# EAGLE schematic TiNRS-Ardabil (EAGLE 7.7.0)

## Sheet 1 of 2
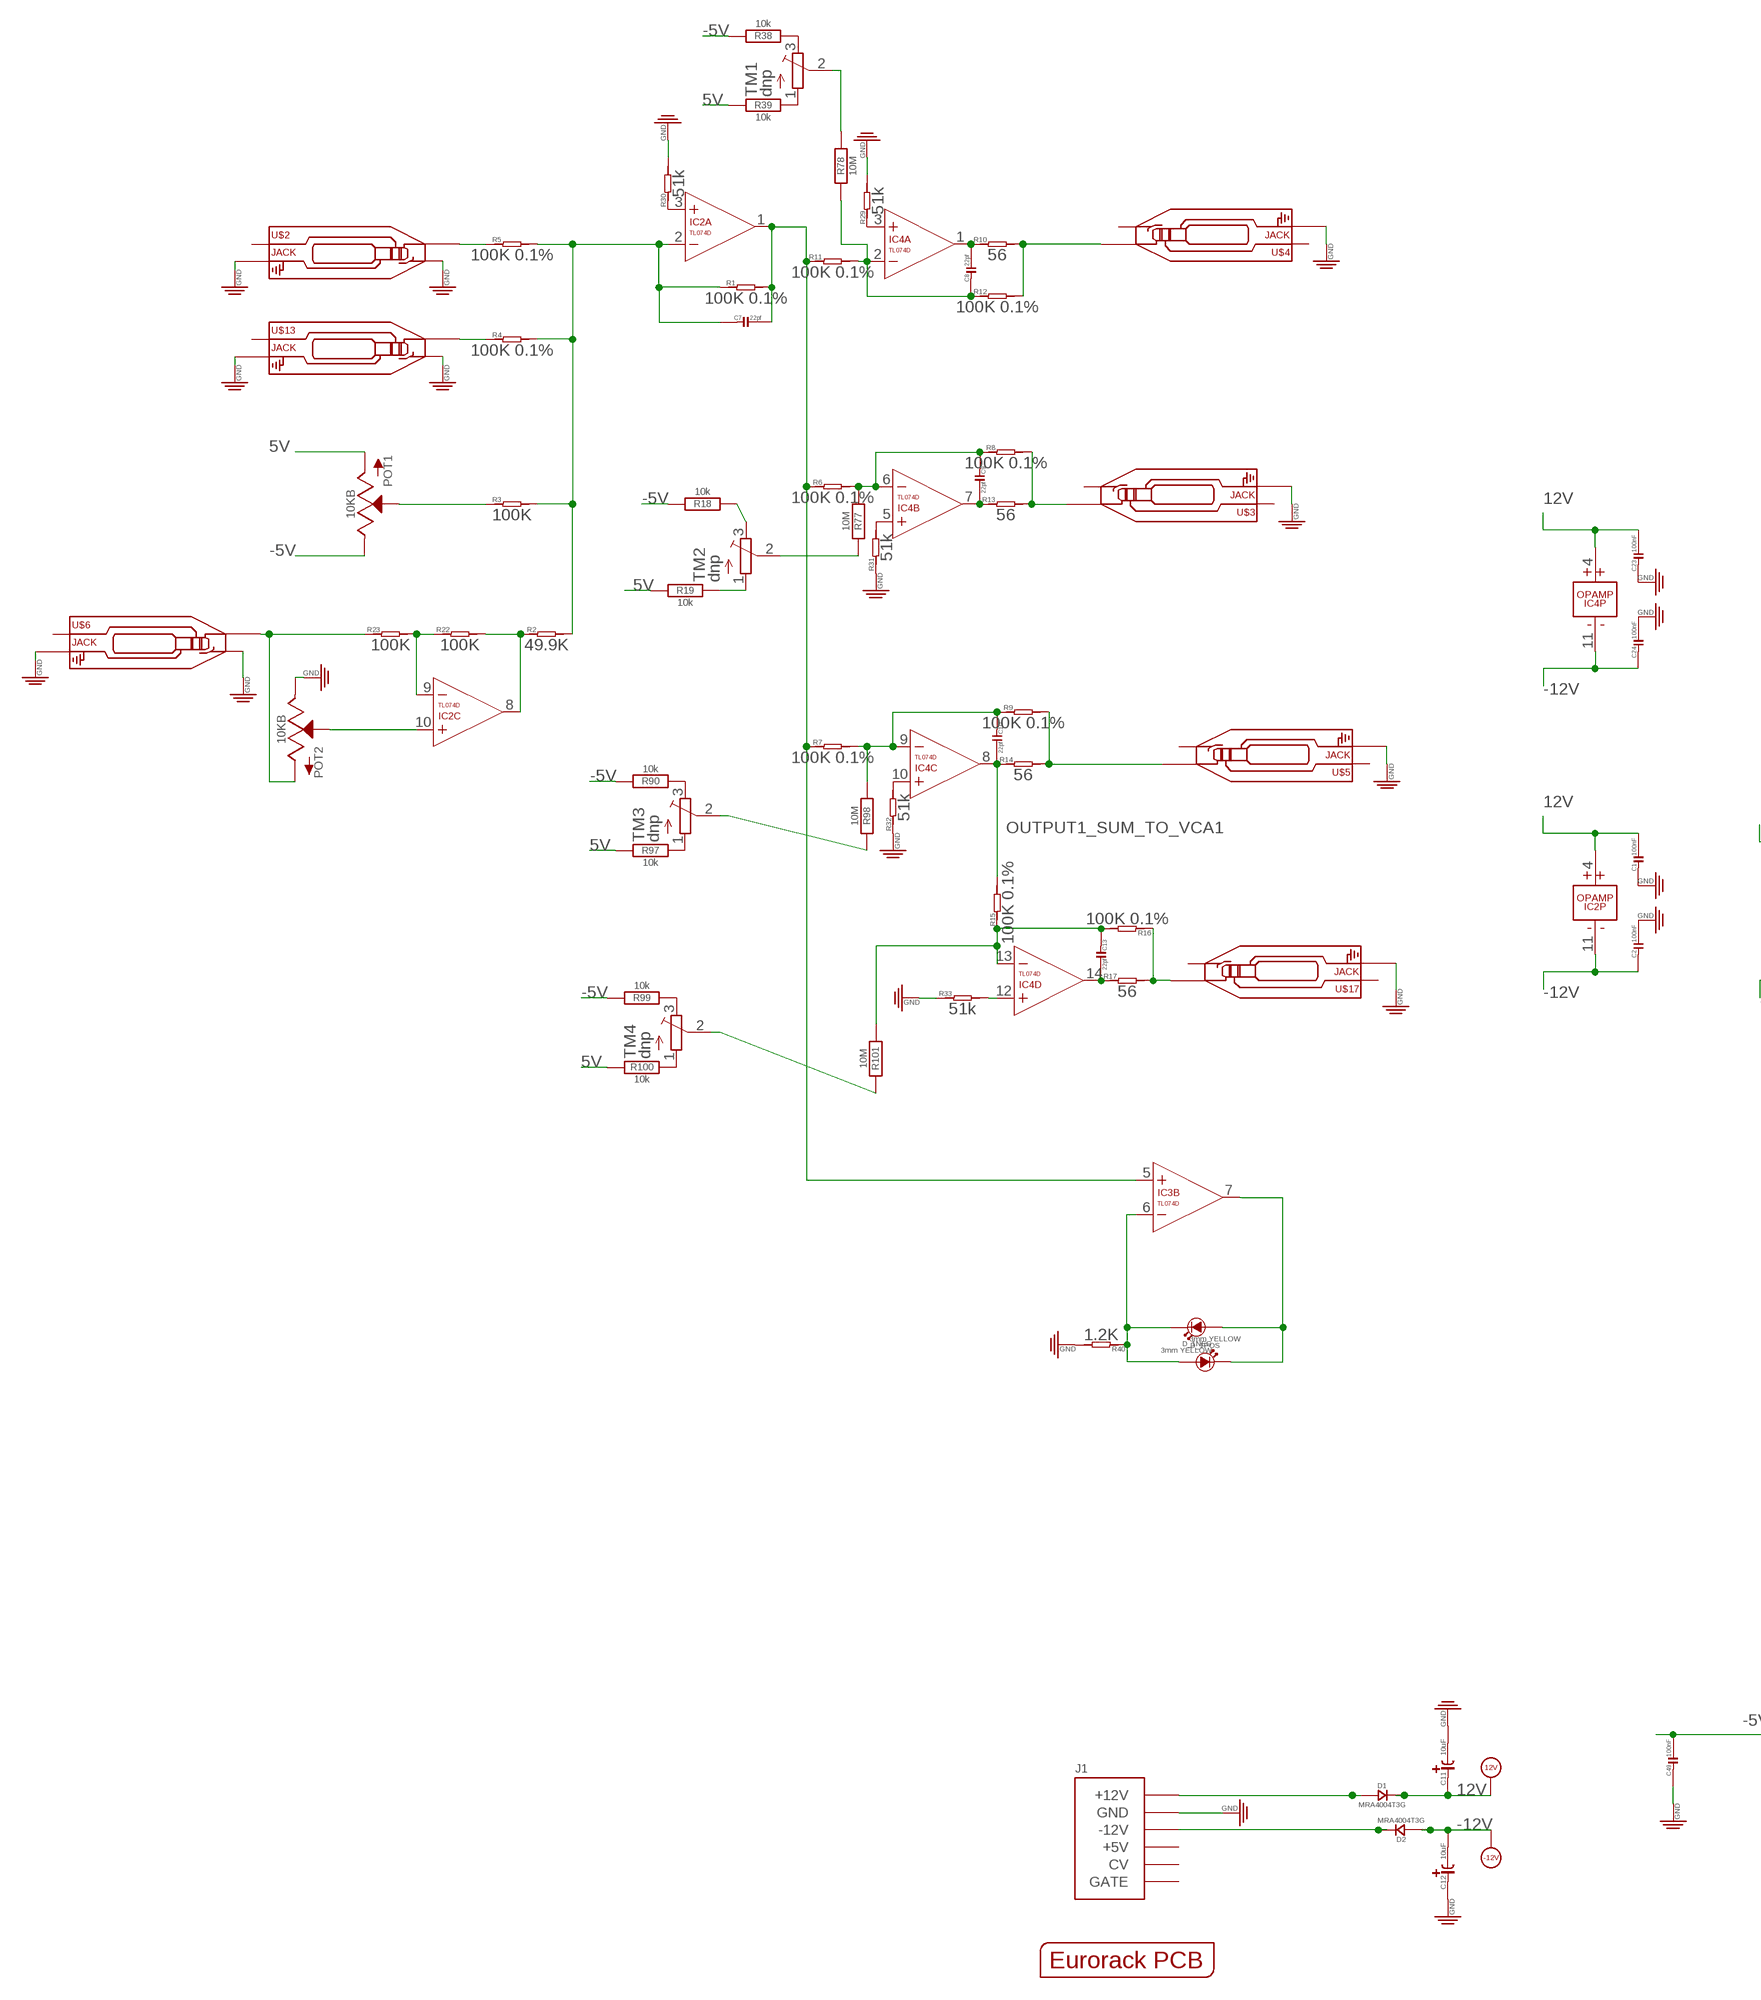
[diagram p0: schematic, sheet 1, part 1 of 2]
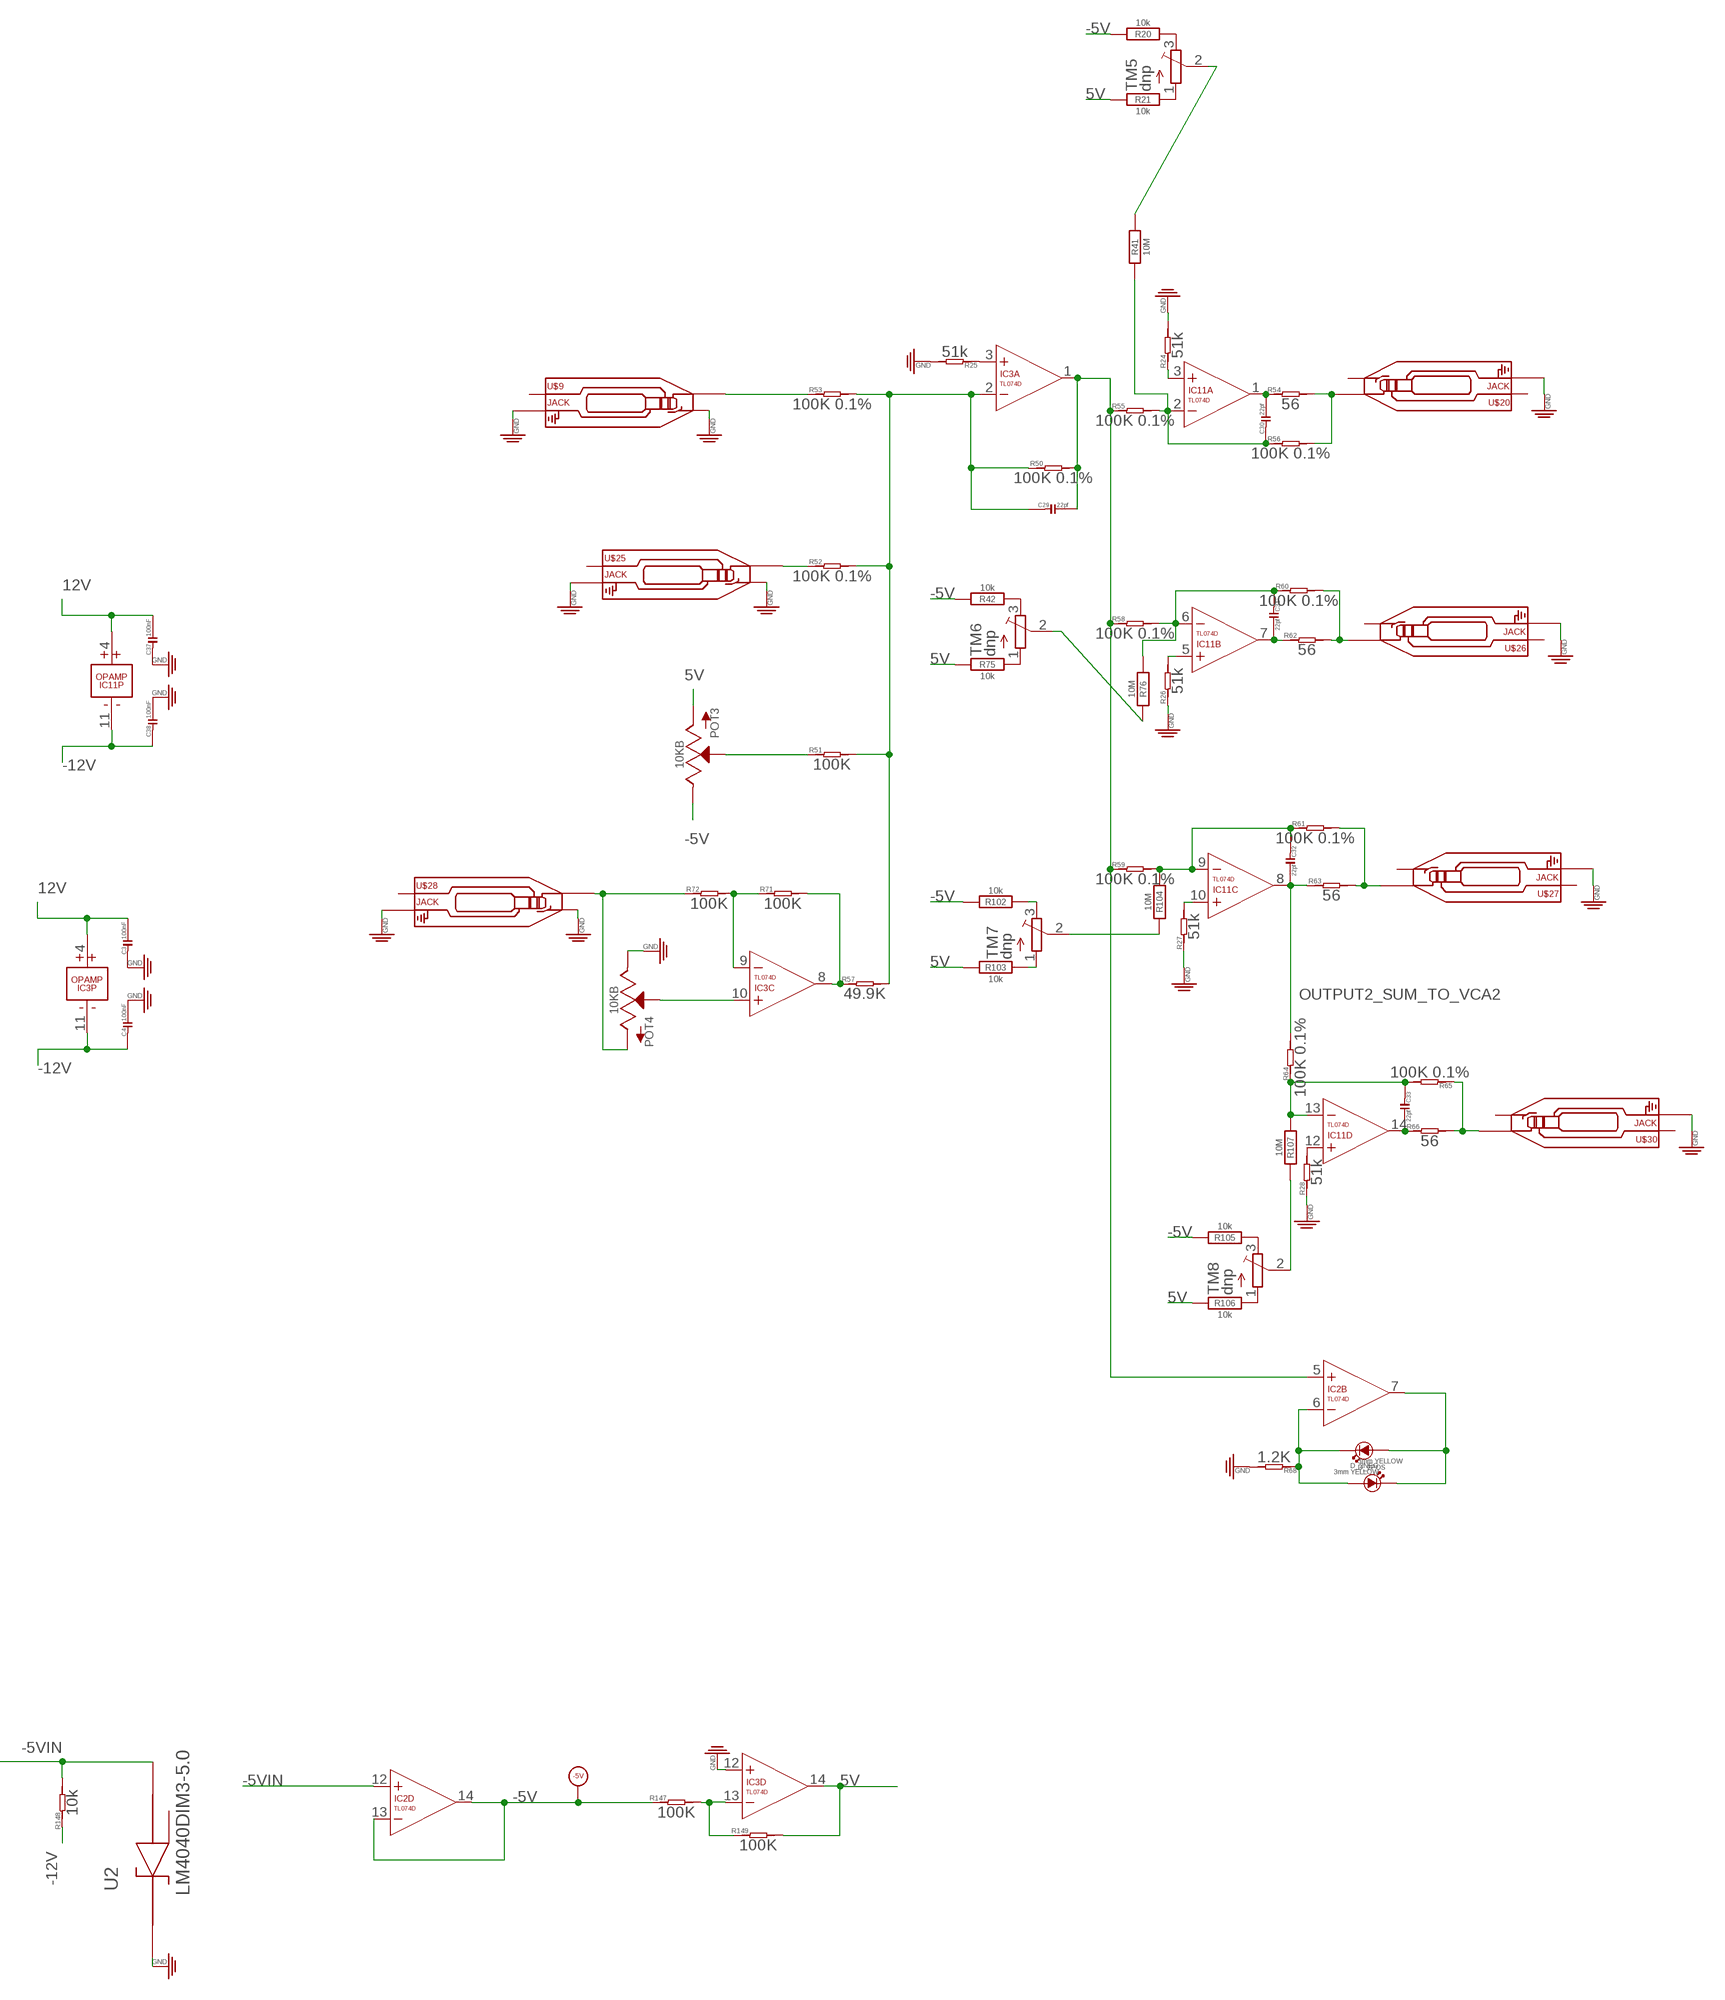
[diagram p1: schematic, sheet 1, part 2 of 2]

### Parts
C1  100nF  C-0603  [C0603]
C2  100nF  C-0603  [C0603]
C3  100nF  C-0603  [C0603]
C4  100nF  C-0603  [C0603]
C7  22pf  C-0603  [C0603]
C8  22pf  C-0603  [C0603]
C9  22pf  C-0603  [C0603]
C10  22pf  C-0603  [C0603]
C11  10uF  C-POLAR-A  [CASE-A_3216]
C12  10uF  C-POLAR-A  [CASE-A_3216]
C13  22pf  C-0603  [C0603]
C23  100nF  C-0603  [C0603]
C24  100nF  C-0603  [C0603]
C29  22pf  C-0603  [C0603]
C30  22pf  C-0603  [C0603]
C31  22pf  C-0603  [C0603]
C32  22pf  C-0603  [C0603]
C33  22pf  C-0603  [C0603]
C37  100nF  C-0603  [C0603]
C38  100nF  C-0603  [C0603]
C49  100nF  C-0603  [C0603]
D1  MRA4004T3G  D-SMA  [DO-214AC]
D2  MRA4004T3G  D-SMA  [DO-214AC]
D_1NEG  3mm YELLOW  LED3MM  [3MMLED]
D_1POS  3mm YELLOW  LED3MM  [3MMLED]
D_2NEG  3mm YELLOW  LED3MM  [3MMLED]
D_2POS  3mm YELLOW  LED3MM  [3MMLED]
IC2  TL074D  [SO14]
IC3  TL074D  [SO14]
IC4  TL074D  [SO14]
IC11  TL074D  [SO14]
J1  POWER_SHROUDED_NOTEXT  [POWER_16_SHROUDED_NOTEXT]
POT1  10KB  POTSQUAREHOLE_SMALLKNOB  [ALPS_POT_SQUAREHOLES]
POT2  10KB  POTSQUAREHOLE_SMALLKNOB  [ALPS_POT_SQUAREHOLES]
POT3  10KB  POTSQUAREHOLE_SMALLKNOB  [ALPS_POT_SQUAREHOLES]
POT4  10KB  POTSQUAREHOLE_SMALLKNOB  [ALPS_POT_SQUAREHOLES]
R1  100K 0.1%  R-0603  [R0603]
R2  49.9K  R-0603  [R0603]
R3  100K  R-0603  [R0603]
R4  100K 0.1%  R-0603  [R0603]
R5  100K 0.1%  R-0603  [R0603]
R6  100K 0.1%  R-0603  [R0603]
R7  100K 0.1%  R-0603  [R0603]
R8  100K 0.1%  R-0603  [R0603]
R9  100K 0.1%  R-0603  [R0603]
R10  56  R-0603  [R0603]
R11  100K 0.1%  R-0603  [R0603]
R12  100K 0.1%  R-0603  [R0603]
R13  56  R-0603  [R0603]
R14  56  R-0603  [R0603]
R15  100K 0.1%  R-0603  [R0603]
R16  100K 0.1%  R-0603  [R0603]
R17  56  R-0603  [R0603]
R18  10k  R-EU_R0402  [R0402]
R19  10k  R-EU_R0402  [R0402]
R20  10k  R-EU_R0402  [R0402]
R21  10k  R-EU_R0402  [R0402]
R22  100K  R-0603  [R0603]
R23  100K  R-0603  [R0603]
R24  51k  R-0603  [R0603]
R25  51k  R-0603  [R0603]
R26  51k  R-0603  [R0603]
R27  51k  R-0603  [R0603]
R28  51k  R-0603  [R0603]
R29  51k  R-0603  [R0603]
R30  51k  R-0603  [R0603]
R31  51k  R-0603  [R0603]
R32  51k  R-0603  [R0603]
R33  51k  R-0603  [R0603]
R38  10k  R-EU_R0402  [R0402]
R39  10k  R-EU_R0402  [R0402]
R40  1.2K  R-0603  [R0603]
R41  10M  R-EU_R0402  [R0402]
R42  10k  R-EU_R0402  [R0402]
R50  100K 0.1%  R-0603  [R0603]
R51  100K  R-0603  [R0603]
R52  100K 0.1%  R-0603  [R0603]
R53  100K 0.1%  R-0603  [R0603]
R54  56  R-0603  [R0603]
R55  100K 0.1%  R-0603  [R0603]
R56  100K 0.1%  R-0603  [R0603]
R57  49.9K  R-0603  [R0603]
R58  100K 0.1%  R-0603  [R0603]
R59  100K 0.1%  R-0603  [R0603]
R60  100K 0.1%  R-0603  [R0603]
R61  100K 0.1%  R-0603  [R0603]
R62  56  R-0603  [R0603]
R63  56  R-0603  [R0603]
R64  100K 0.1%  R-0603  [R0603]
R65  100K 0.1%  R-0603  [R0603]
R66  56  R-0603  [R0603]
R68  1.2K  R-0603  [R0603]
R71  100K  R-0603  [R0603]
R72  100K  R-0603  [R0603]
R75  10k  R-EU_R0402  [R0402]
R76  10M  R-EU_R0402  [R0402]
R77  10M  R-EU_R0402  [R0402]
R78  10M  R-EU_R0402  [R0402]
R90  10k  R-EU_R0402  [R0402]
R97  10k  R-EU_R0402  [R0402]
R98  10M  R-EU_R0402  [R0402]
R99  10k  R-EU_R0402  [R0402]
R100  10k  R-EU_R0402  [R0402]
R101  10M  R-EU_R0402  [R0402]
R102  10k  R-EU_R0402  [R0402]
R103  10k  R-EU_R0402  [R0402]
R104  10M  R-EU_R0402  [R0402]
R105  10k  R-EU_R0402  [R0402]
R106  10k  R-EU_R0402  [R0402]
R107  10M  R-EU_R0402  [R0402]
R147  100K  R-0603  [R0603]
R148  10k  R-0603  [R0603]
R149  100K  R-0603  [R0603]
TM1  dnp  TRIMPOTTC33X  [TC33X]
TM2  dnp  TRIMPOTTC33X  [TC33X]
TM3  dnp  TRIMPOTTC33X  [TC33X]
TM4  dnp  TRIMPOTTC33X  [TC33X]
TM5  dnp  TRIMPOTTC33X  [TC33X]
TM6  dnp  TRIMPOTTC33X  [TC33X]
TM7  dnp  TRIMPOTTC33X  [TC33X]
TM8  dnp  TRIMPOTTC33X  [TC33X]
U2  LM4040DIM3-5.0  [SOT95P237X112-3N]
U$1  EURORACK_PCB12HP  [EURORACK12HPPCB]
U$2  JACK  AUDIO-JACK_SMALLSYMBOL  [3.5MM-JACK-SWITCH-13MM-NOHOLES-TESTPAD]
U$3  JACK  AUDIO-JACK_SMALLSYMBOL  [3.5MM-JACK-SWITCH-13MM-NOHOLES-TESTPAD]
U$4  JACK  AUDIO-JACK_SMALLSYMBOL  [3.5MM-JACK-SWITCH-13MM-NOHOLES-TESTPAD]
U$5  JACK  AUDIO-JACK_SMALLSYMBOL  [3.5MM-JACK-SWITCH-13MM-NOHOLES-TESTPAD]
U$6  JACK  AUDIO-JACK_SMALLSYMBOL  [3.5MM-JACK-SWITCH-13MM-NOHOLES-TESTPAD]
U$9  JACK  AUDIO-JACK_SMALLSYMBOL  [3.5MM-JACK-SWITCH-13MM-NOHOLES-TESTPAD]
U$13  JACK  AUDIO-JACK_SMALLSYMBOL  [3.5MM-JACK-SWITCH-13MM-NOHOLES-TESTPAD]
U$17  JACK  AUDIO-JACK_SMALLSYMBOL  [3.5MM-JACK-SWITCH-13MM-NOHOLES-TESTPAD]
U$20  JACK  AUDIO-JACK_SMALLSYMBOL  [3.5MM-JACK-SWITCH-13MM-NOHOLES-TESTPAD]
U$25  JACK  AUDIO-JACK_SMALLSYMBOL  [3.5MM-JACK-SWITCH-13MM-NOHOLES-TESTPAD]
U$26  JACK  AUDIO-JACK_SMALLSYMBOL  [3.5MM-JACK-SWITCH-13MM-NOHOLES-TESTPAD]
U$27  JACK  AUDIO-JACK_SMALLSYMBOL  [3.5MM-JACK-SWITCH-13MM-NOHOLES-TESTPAD]
U$28  JACK  AUDIO-JACK_SMALLSYMBOL  [3.5MM-JACK-SWITCH-13MM-NOHOLES-TESTPAD]
U$30  JACK  AUDIO-JACK_SMALLSYMBOL  [3.5MM-JACK-SWITCH-13MM-NOHOLES-TESTPAD]

### Nets
5V [heavypower]: IC3.14(D:OUT) POT1.P$3(A) POT3.P$3(A) R19.2 R21.2 R39.2 R75.2 R97.2 R100.2 R103.2 R106.2 R149.2
12V [heavypower]: C1.2 C3.2 C11.+ C23.2 C37.2 D1.2(-) IC2.4(P:V+) IC3.4(P:V+) IC4.4(P:V+) IC11.4(P:V+) ; also sheet 2
-5V [heavypower]: IC2.13(D:-IN) IC2.14(D:OUT) POT1.P$1(E) POT3.P$1(E) R18.1 R20.1 R38.1 R42.1 R90.1 R99.1 R102.1 R105.1 R147.1 ; also sheet 2
-5V_TO_5V: IC3.13(D:-IN) R147.2 R149.1
-5VIN [heavypower]: C49.2 IC2.12(D:+IN) R148.2 U2.2(ANODE)
-12V [heavypower]: C2.1 C4.1 C12.- C24.1 C38.1 D2.1(+) IC2.11(P:V-) IC3.11(P:V-) IC4.11(P:V-) IC11.11(P:V-) R148.1 ; also sheet 2
GND: C1.1 C2.2 C3.1 C4.2 C11.- C12.+ C23.1 C24.2 C37.1 C38.2 C49.1 IC3.12(D:+IN) J1.3(GND) J1.4(GND) J1.5(GND) J1.6(GND) J1.7(GND) J1.8(GND) POT2.P$1(E) POT4.P$1(E) R24.2 R25.2 R26.1 R27.1 R28.1 R29.2 R30.2 R31.1 R32.1 R33.1 R40.2 R68.2 U2.1(CATHODE) U$2.RING_B@1(RING) U$2.RING_T@3(RING) U$2.SWITCH_B@1(SWITCH) U$2.SWITCH_T@3(SWITCH) U$3.RING_B@1(RING) U$3.RING_T@3(RING) U$4.RING_B@1(RING) U$4.RING_T@3(RING) U$5.RING_B@1(RING) U$5.RING_T@3(RING) U$6.RING_B@1(RING) U$6.RING_T@3(RING) U$6.SWITCH_B@1(SWITCH) U$6.SWITCH_T@3(SWITCH) U$9.RING_B@1(RING) U$9.RING_T@3(RING) U$9.SWITCH_B@1(SWITCH) U$9.SWITCH_T@3(SWITCH) U$13.RING_B@1(RING) U$13.RING_T@3(RING) U$13.SWITCH_B@1(SWITCH) U$13.SWITCH_T@3(SWITCH) U$17.RING_B@1(RING) U$17.RING_T@3(RING) U$20.RING_B@1(RING) U$20.RING_T@3(RING) U$25.RING_B@1(RING) U$25.RING_T@3(RING) U$25.SWITCH_B@1(SWITCH) U$25.SWITCH_T@3(SWITCH) U$26.RING_B@1(RING) U$26.RING_T@3(RING) U$27.RING_B@1(RING) U$27.RING_T@3(RING) U$28.RING_B@1(RING) U$28.RING_T@3(RING) U$28.SWITCH_B@1(SWITCH) U$28.SWITCH_T@3(SWITCH) U$30.RING_B@1(RING) U$30.RING_T@3(RING) ; also sheet 2
N$1: IC2.10(C:+IN) POT2.P$2(S)
N$2: C8.2 IC4.1(A:OUT) R10.1
N$3: IC2.8(C:OUT) R2.1 R22.2
N$4: POT2.P$3(A) R23.1 U$6.TIP_B@1(TIP) U$6.TIP_T@3(TIP)
N$5: C9.1 IC4.6(B:-IN) R6.2 R8.1 R77.2
N$6: POT1.P$2(S) R3.1
N$7: C7.2 IC2.1(A:OUT) IC3.5(B:+IN) R1.2 R6.1 R7.1 R11.1
N$8: R38.2 TM1.3(E)
N$9: C10.1 IC4.9(C:-IN) R7.2 R9.1 R98.2
N$10: IC2.9(C:-IN) R22.1 R23.2
N$11: C9.2 IC4.7(B:OUT) R13.1
N$12: R4.1 U$13.TIP_B@1(TIP) U$13.TIP_T@3(TIP)
N$13: R60.2 R62.2 U$26.TIP_B@1(TIP) U$26.TIP_T@3(TIP)
N$14: C7.1 IC2.2(A:-IN) R1.1 R2.2 R3.2 R4.2 R5.2
N$15: R8.2 R13.2 U$3.TIP_B@1(TIP) U$3.TIP_T@3(TIP)
N$16: R9.2 R14.2 U$5.TIP_B@1(TIP) U$5.TIP_T@3(TIP)
N$17: C13.1 IC4.13(D:-IN) R15.1 R16.2 R101.2
N$18: C13.2 IC4.14(D:OUT) R17.1
N$19: R16.1 R17.2 U$17.TIP_B@1(TIP) U$17.TIP_T@3(TIP)
N$20: R5.1 U$2.TIP_B@1(TIP) U$2.TIP_T@3(TIP)
N$21: R20.2 TM5.3(E)
N$22: R10.2 R12.2 U$4.TIP_B@1(TIP) U$4.TIP_T@3(TIP)
N$23: IC11.12(D:+IN) R28.2
N$24: IC11.10(C:+IN) R27.2
N$25: IC11.3(A:+IN) R24.1
N$27: IC3.3(A:+IN) R25.1
N$28 [heavypower]: D1.1(+) J1.9(+12V) J1.10(+12V)
N$29: IC11.5(B:+IN) R26.2
N$31: R65.1 R66.2 U$30.TIP_B@1(TIP) U$30.TIP_T@3(TIP)
N$32: R21.1 TM5.1(A)
N$33: R39.1 TM1.1(A)
N$34: IC2.3(A:+IN) R30.1
N$35: R18.2 TM2.3(E)
N$36: IC4.10(C:+IN) R32.2
N$37: IC4.12(D:+IN) R33.2
N$44: D_1NEG.- D_1POS.+ IC3.6(B:-IN) R40.1
N$45: D_1NEG.+ D_1POS.- IC3.7(B:OUT)
N$46: IC4.5(B:+IN) R31.2
N$47: C8.1 IC4.2(A:-IN) R11.2 R12.1 R78.2
N$48: IC4.3(A:+IN) R29.1
N$49: R78.1 TM1.2(S)
N$50: R19.1 TM2.1(A)
N$51: R77.1 TM2.2(S)
N$52: R90.2 TM3.3(E)
N$53: C30.2 IC11.1(A:OUT) R54.1
N$54: POT3.P$2(S) R51.1
N$55: R97.1 TM3.1(A)
N$56: R98.1 TM3.2(S)
N$57: R99.2 TM4.3(E)
N$58: R100.1 TM4.1(A)
N$59: R101.1 TM4.2(S)
N$60: R41.1 TM5.2(S)
N$62: R42.2 TM6.3(E)
N$63: R52.1 U$25.TIP_B@1(TIP) U$25.TIP_T@3(TIP)
N$64 [heavypower]: D2.2(-) J1.1(-12V) J1.2(-12V)
N$65: C29.1 IC3.2(A:-IN) R50.1 R51.2 R52.2 R53.2 R57.2
N$66: R54.2 R56.2 U$20.TIP_B@1(TIP) U$20.TIP_T@3(TIP)
N$67: C29.2 IC2.5(B:+IN) IC3.1(A:OUT) R50.2 R55.1 R58.1 R59.1
N$68: C30.1 IC11.2(A:-IN) R41.2 R55.2 R56.1
N$69: R53.1 U$9.TIP_B@1(TIP) U$9.TIP_T@3(TIP)
N$70: POT4.P$3(A) R72.1 U$28.TIP_B@1(TIP) U$28.TIP_T@3(TIP)
N$71: C31.1 IC11.6(B:-IN) R58.2 R60.1 R76.2
N$72: C32.1 IC11.9(C:-IN) R59.2 R61.1 R104.2
N$73: C31.2 IC11.7(B:OUT) R62.1
N$75: R75.1 TM6.1(A)
N$76: R61.2 R63.2 U$27.TIP_B@1(TIP) U$27.TIP_T@3(TIP)
N$77: C33.1 IC11.13(D:-IN) R64.1 R65.2 R107.2
N$78: C33.2 IC11.14(D:OUT) R66.1
N$79: R76.1 TM6.2(S)
N$80: D_2NEG.- D_2POS.+ IC2.6(B:-IN) R68.1
N$81: D_2NEG.+ D_2POS.- IC2.7(B:OUT)
N$82: R102.2 TM7.3(E)
N$83: R103.1 TM7.1(A)
N$84: IC3.10(C:+IN) POT4.P$2(S)
N$85: IC3.8(C:OUT) R57.1 R71.2
N$86: IC3.9(C:-IN) R71.1 R72.2
N$101: R104.1 TM7.2(S)
N$102: R105.2 TM8.3(E)
N$103: R106.1 TM8.1(A)
N$104: R107.1 TM8.2(S)
OUTPUT1_SUM_TO_VCA1: C10.2 IC4.8(C:OUT) R14.1 R15.2 ; also sheet 2
OUTPUT2_SUM_TO_VCA2: C32.2 IC11.8(C:OUT) R63.1 R64.2 ; also sheet 2
Unconnected: J1.11(+5V) J1.12(+5V) J1.13(CV) J1.14(CV) J1.15(GATE) J1.16(GATE) U2.3(NC) U$2.SECOND_B@1(SECOND) U$2.SECOND_T@3(SECOND) U$3.SECOND_B@1(SECOND) U$3.SECOND_T@3(SECOND) U$3.SWITCH_B@1(SWITCH) U$3.SWITCH_T@3(SWITCH) U$4.SECOND_B@1(SECOND) U$4.SECOND_T@3(SECOND) U$4.SWITCH_B@1(SWITCH) U$4.SWITCH_T@3(SWITCH) U$5.SECOND_B@1(SECOND) U$5.SECOND_T@3(SECOND) U$5.SWITCH_B@1(SWITCH) U$5.SWITCH_T@3(SWITCH) U$6.SECOND_B@1(SECOND) U$6.SECOND_T@3(SECOND) U$9.SECOND_B@1(SECOND) U$9.SECOND_T@3(SECOND) U$13.SECOND_B@1(SECOND) U$13.SECOND_T@3(SECOND) U$17.SECOND_B@1(SECOND) U$17.SECOND_T@3(SECOND) U$17.SWITCH_B@1(SWITCH) U$17.SWITCH_T@3(SWITCH) U$20.SECOND_B@1(SECOND) U$20.SECOND_T@3(SECOND) U$20.SWITCH_B@1(SWITCH) U$20.SWITCH_T@3(SWITCH) U$25.SECOND_B@1(SECOND) U$25.SECOND_T@3(SECOND) U$26.SECOND_B@1(SECOND) U$26.SECOND_T@3(SECOND) U$26.SWITCH_B@1(SWITCH) U$26.SWITCH_T@3(SWITCH) U$27.SECOND_B@1(SECOND) U$27.SECOND_T@3(SECOND) U$27.SWITCH_B@1(SWITCH) U$27.SWITCH_T@3(SWITCH) U$28.SECOND_B@1(SECOND) U$28.SECOND_T@3(SECOND) U$30.SECOND_B@1(SECOND) U$30.SECOND_T@3(SECOND) U$30.SWITCH_B@1(SWITCH) U$30.SWITCH_T@3(SWITCH)

## Sheet 2 of 2
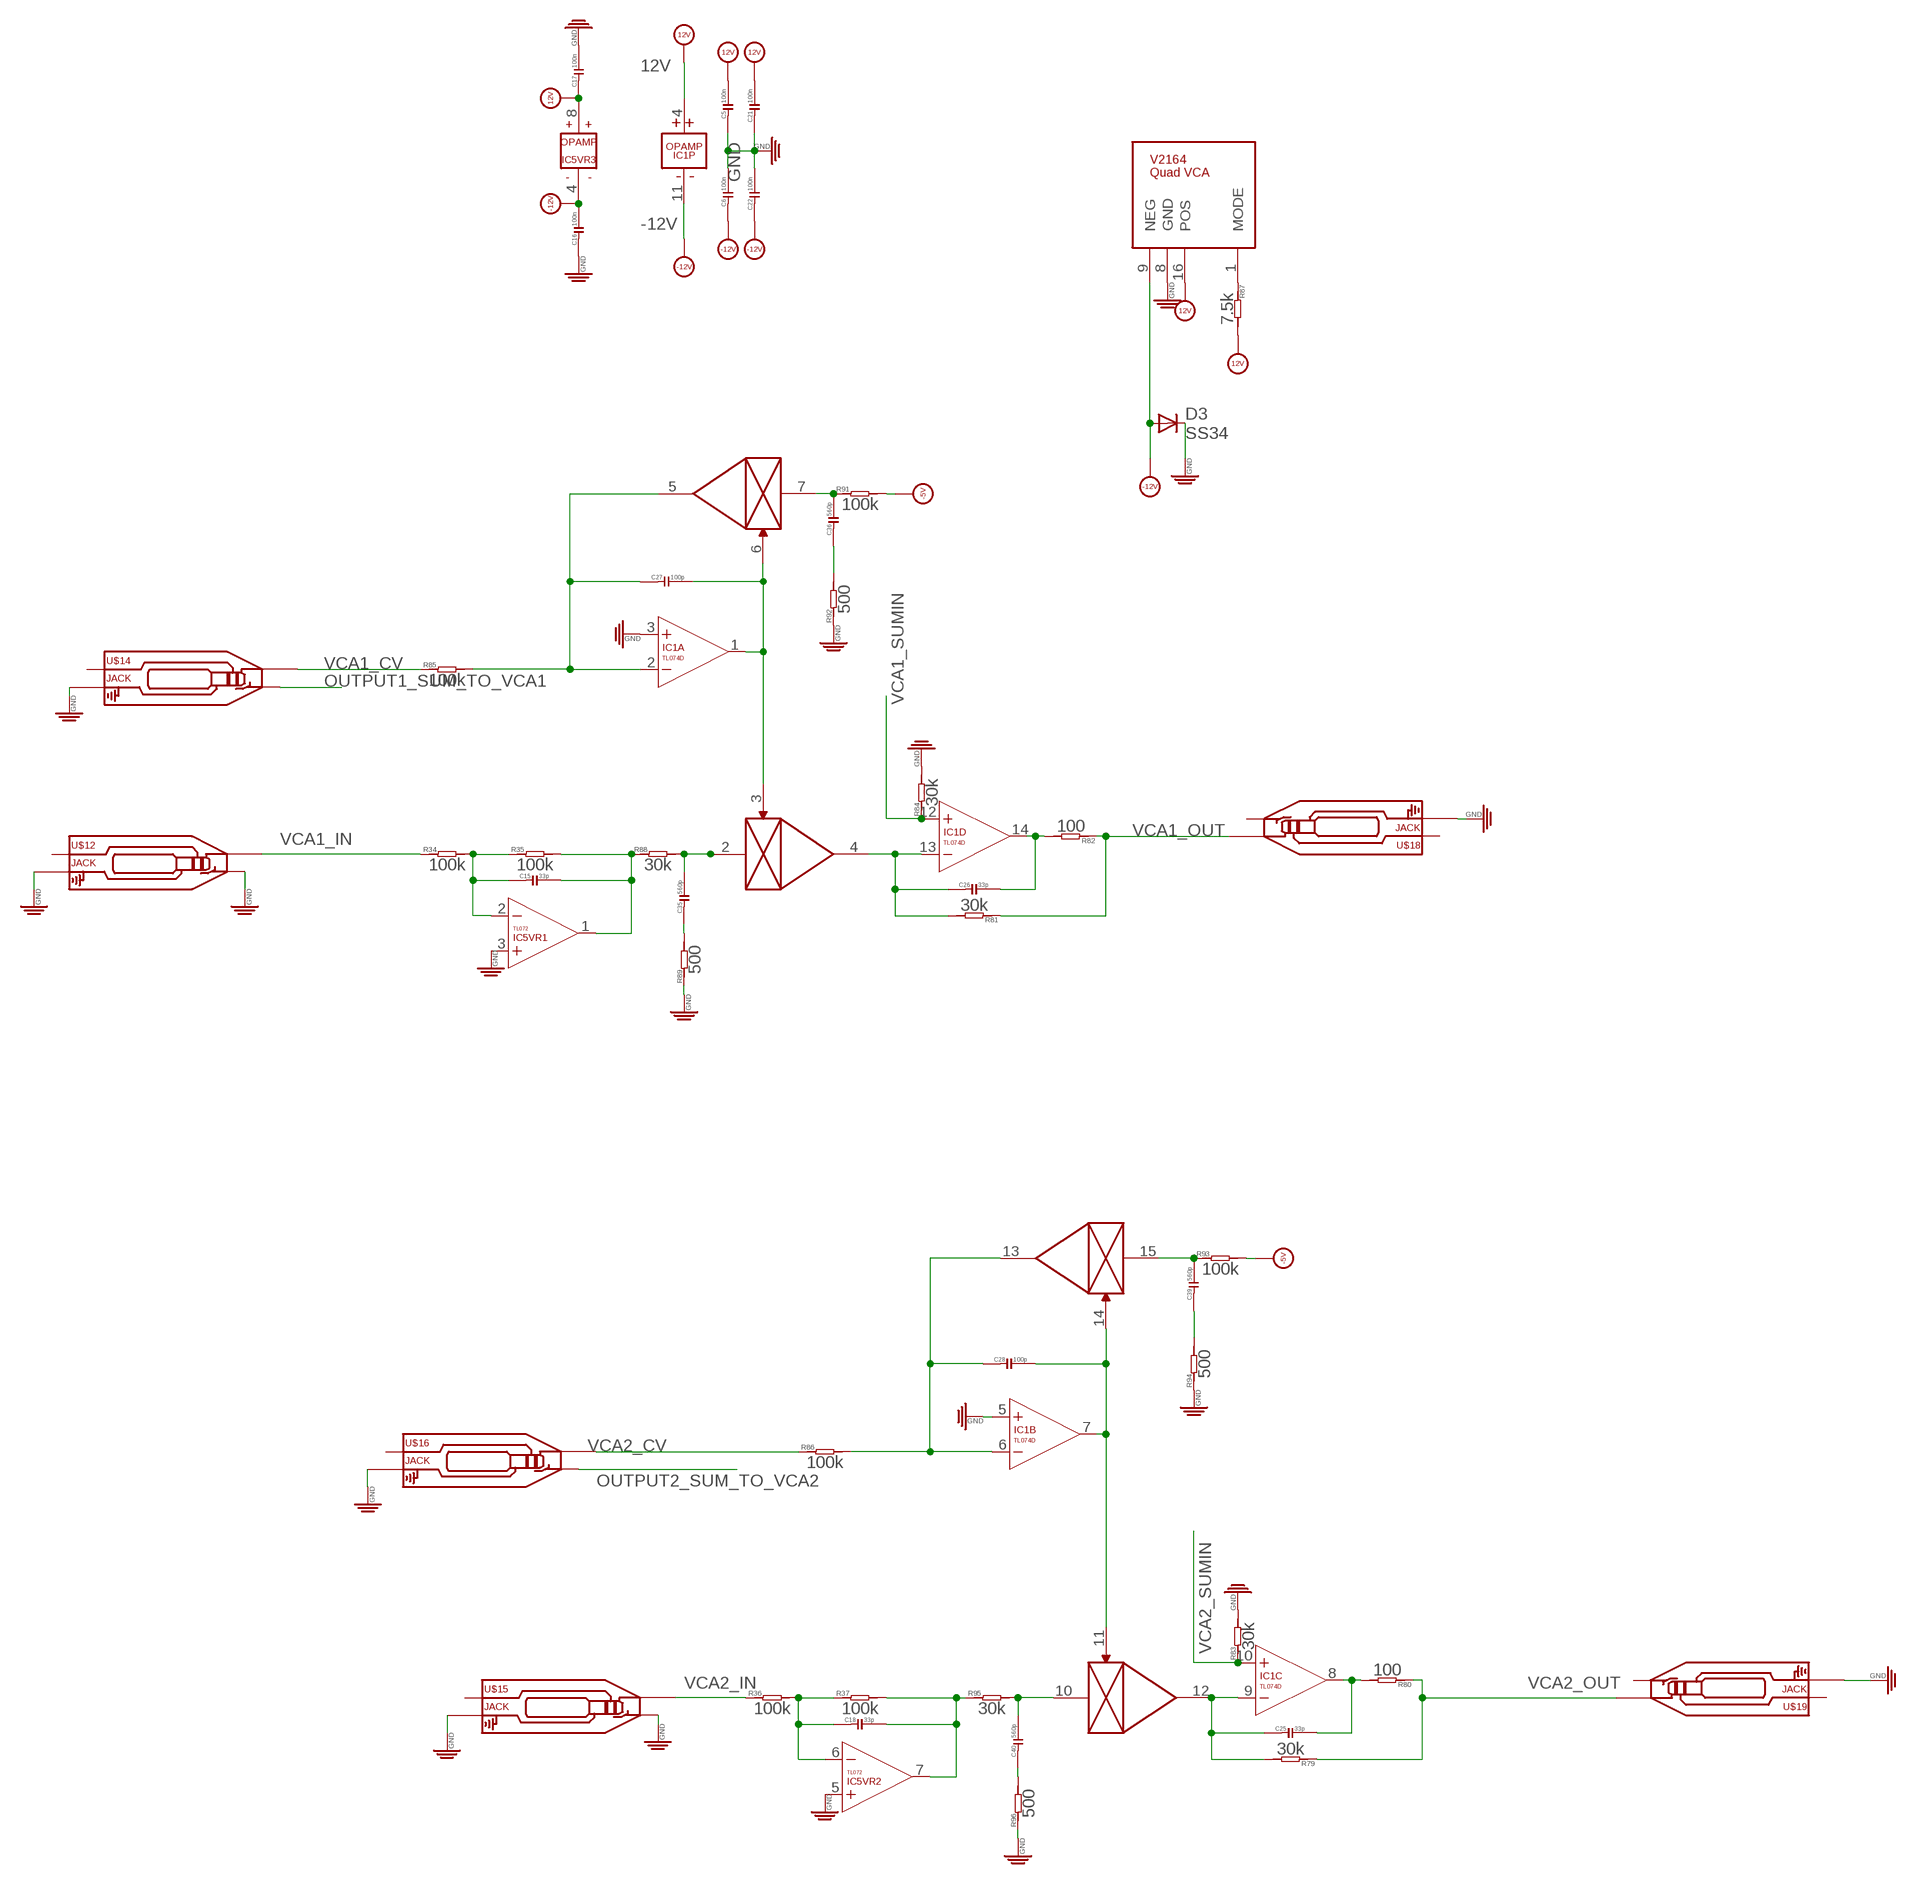
[diagram p2: schematic, sheet 2]

### Parts
C5  100n  C-0603  [C0603]
C6  100n  C-0603  [C0603]
C15  33p  C-0603  [C0603]
C16  100n  C-0603  [C0603]
C17  100n  C-0603  [C0603]
C18  33p  C-0603  [C0603]
C21  100n  C-0603  [C0603]
C22  100n  C-0603  [C0603]
C25  33p  C-0603  [C0603]
C26  33p  C-0603  [C0603]
C27  100p  C-0603  [C0603]
C28  100p  C-0603  [C0603]
C35  560p  C-0603  [C0603]
C36  560p  C-0603  [C0603]
C39  560p  C-0603  [C0603]
C40  560p  C-0603  [C0603]
D3  SS34  DIODE-DO-214AC  [DO-214AC]
IC1  TL074D  [SO14]
IC5  TL072  [SO08]
R34  100k  R-0603  [R0603]
R35  100k  R-0603  [R0603]
R36  100k  R-0603  [R0603]
R37  100k  R-0603  [R0603]
R79  30k  R-0603  [R0603]
R80  100  R-0603  [R0603]
R81  30k  R-0603  [R0603]
R82  100  R-0603  [R0603]
R83  30k  R-0603  [R0603]
R84  30k  R-0603  [R0603]
R85  100k  R-0603  [R0603]
R86  100k  R-0603  [R0603]
R87  7.5k  R-0603  [R0603]
R88  30k  R-0603  [R0603]
R89  500  R-0603  [R0603]
R91  100k  R-0603  [R0603]
R92  500  R-0603  [R0603]
R93  100k  R-0603  [R0603]
R94  500  R-0603  [R0603]
R95  30k  R-0603  [R0603]
R96  500  R-0603  [R0603]
U$12  JACK  AUDIO-JACK_SMALLSYMBOL  [3.5MM-JACK-SWITCH-13MM-NOHOLES-TESTPAD]
U$14  JACK  AUDIO-JACK_SMALLSYMBOL  [3.5MM-JACK-SWITCH-13MM-NOHOLES-TESTPAD]
U$15  JACK  AUDIO-JACK_SMALLSYMBOL  [3.5MM-JACK-SWITCH-13MM-NOHOLES-TESTPAD]
U$16  JACK  AUDIO-JACK_SMALLSYMBOL  [3.5MM-JACK-SWITCH-13MM-NOHOLES-TESTPAD]
U$18  JACK  AUDIO-JACK_SMALLSYMBOL  [3.5MM-JACK-SWITCH-13MM-NOHOLES-TESTPAD]
U$19  JACK  AUDIO-JACK_SMALLSYMBOL  [3.5MM-JACK-SWITCH-13MM-NOHOLES-TESTPAD]
U$32  V2164  [SO16]

### Nets
12V [heavypower]: C5.2 C17.1 C21.2 IC1.4(P:V+) IC5.8(VR3:V+) R87.2 U$32.16(PWR:POS) ; also sheet 1
-5V [heavypower]: R91.2 R93.2 ; also sheet 1
-12V [heavypower]: C6.1 C16.2 C22.1 D3.2(A) IC1.11(P:V-) IC5.4(VR3:V-) U$32.9(PWR:NEG) ; also sheet 1
GND: C5.1 C6.2 C16.1 C17.2 C21.1 C22.2 D3.1(C) IC1.3(A:+IN) IC1.5(B:+IN) IC5.3(VR1:+IN) IC5.5(VR2:+IN) R83.2 R84.2 R89.1 R92.1 R94.1 R96.1 U$12.RING_B@1(RING) U$12.RING_T@3(RING) U$12.SWITCH_B@1(SWITCH) U$12.SWITCH_T@3(SWITCH) U$14.RING_B@1(RING) U$14.RING_T@3(RING) U$15.RING_B@1(RING) U$15.RING_T@3(RING) U$15.SWITCH_B@1(SWITCH) U$15.SWITCH_T@3(SWITCH) U$16.RING_B@1(RING) U$16.RING_T@3(RING) U$18.RING_B@1(RING) U$18.RING_T@3(RING) U$19.RING_B@1(RING) U$19.RING_T@3(RING) U$32.8(PWR:GND) ; also sheet 1
N$38: C15.1 IC5.2(VR1:-IN) R34.2 R35.1
N$39: C15.2 IC5.1(VR1:OUT) R35.2 R88.1
N$40: C18.1 IC5.6(VR2:-IN) R36.2 R37.1
N$41: C18.2 IC5.7(VR2:OUT) R37.2 R95.1
N$61: C25.2 IC1.8(C:OUT) R80.2
N$74: C25.1 IC1.9(C:-IN) R79.2 U$32.12(C:OUT)
N$87: C26.2 IC1.14(D:OUT) R82.2
N$88: C26.1 IC1.13(D:-IN) R81.2 U$32.4(A:OUT)
N$89: C27.2 IC1.1(A:OUT) U$32.3(A:CV) U$32.6(B:CV)
N$90: C28.1 IC1.6(B:-IN) R86.2 U$32.13(D:OUT)
N$91: C28.2 IC1.7(B:OUT) U$32.11(C:CV) U$32.14(D:CV)
N$92: R87.1 U$32.1(PWR:MODE)
N$93: C35.1 R89.2
N$94: C35.2 R88.2 U$32.2(A:IN)
N$95: C36.2 R91.1 U$32.7(B:IN)
N$96: C36.1 R92.2
N$97: C39.2 R93.1 U$32.15(D:IN)
N$98: C39.1 R94.2
N$99: C40.1 R96.2
N$100: C40.2 R95.2 U$32.10(C:IN)
OUTPUT1_SUM_TO_VCA1: U$14.SWITCH_B@1(SWITCH) U$14.SWITCH_T@3(SWITCH) ; also sheet 1
OUTPUT2_SUM_TO_VCA2: U$16.SWITCH_B@1(SWITCH) U$16.SWITCH_T@3(SWITCH) ; also sheet 1
VCA1_CV: R85.1 U$14.TIP_B@1(TIP) U$14.TIP_T@3(TIP)
VCA1_FB: C27.1 IC1.2(A:-IN) R85.2 U$32.5(B:OUT)
VCA1_IN: R34.1 U$12.TIP_B@1(TIP) U$12.TIP_T@3(TIP)
VCA1_OUT: R81.1 R82.1 U$18.TIP_B@1(TIP) U$18.TIP_T@3(TIP)
VCA1_SUMIN: IC1.12(D:+IN) R84.1
VCA2_CV: R86.1 U$16.TIP_B@1(TIP) U$16.TIP_T@3(TIP)
VCA2_IN: R36.1 U$15.TIP_B@1(TIP) U$15.TIP_T@3(TIP)
VCA2_OUT: R79.1 R80.1 U$19.TIP_B@1(TIP) U$19.TIP_T@3(TIP)
VCA2_SUMIN: IC1.10(C:+IN) R83.1
Unconnected: U$12.SECOND_B@1(SECOND) U$12.SECOND_T@3(SECOND) U$14.SECOND_B@1(SECOND) U$14.SECOND_T@3(SECOND) U$15.SECOND_B@1(SECOND) U$15.SECOND_T@3(SECOND) U$16.SECOND_B@1(SECOND) U$16.SECOND_T@3(SECOND) U$18.SECOND_B@1(SECOND) U$18.SECOND_T@3(SECOND) U$18.SWITCH_B@1(SWITCH) U$18.SWITCH_T@3(SWITCH) U$19.SECOND_B@1(SECOND) U$19.SECOND_T@3(SECOND) U$19.SWITCH_B@1(SWITCH) U$19.SWITCH_T@3(SWITCH)

## Library data of the parts
C1-C10 C13 C15-C18 C21-C33 C35-C40 = OPL:C*
C11 C12 = EurorackModularParts:C-POLAR*
C49 = OPL:C*; MF: AVX; MPN: 06035C104KAT2A; OC_FARNELL: 1301804
D1 D2 = OPL:D*: DIODE; MF: VISHAY; MPN: US1G-E3/5AT; OC_FARNELL: 9551824
D3 = dp_devices:DIODE: Various Diode Packages
D_1NEG D_1POS D_2NEG D_2POS = EurorackModularParts:LED*: LED
IC1-IC4 IC11 = EurorackModularParts:TL074: OP AMP
IC5 = EurorackModularParts:TL072
J1 = EurorackModularParts:POWER
POT1 = EurorackModularParts:POT; DESC: 1: Offset
POT2 = EurorackModularParts:POT; DESC: 1: C Amp
POT3 = EurorackModularParts:POT; DESC: 2: Offset
POT4 = EurorackModularParts:POT; DESC: 2: C Amp
R1-R17 R22-R37 R40 R50-R66 R68 R71 R72 R79-R89 R91-R96 R147 R149 = OPL:R*
R18-R21 R38 R39 R41 R42 R75-R78 R90 R97-R107 = resistor:R-EU_: RESISTOR, European symbol
R148 = OPL:R*; OC_FARNELL: unknown
TM1 TM5 = adafruit:TRIMPOT: SMT trimmer potentiometer part number TC33X http://www.ladyada.net/library/eagle; DESC: 1
TM2 TM6 = adafruit:TRIMPOT: SMT trimmer potentiometer part number TC33X http://www.ladyada.net/library/eagle; DESC: 2
TM3 TM7 = adafruit:TRIMPOT: SMT trimmer potentiometer part number TC33X http://www.ladyada.net/library/eagle; DESC: 3
TM4 TM8 = adafruit:TRIMPOT: SMT trimmer potentiometer part number TC33X http://www.ladyada.net/library/eagle; DESC: i
U2 = FarnellThings:LM4040DIM3-5.0: IC, Precision Micropower Shunt Voltage Reference, 5V,SOT-23-3; MF: TEXAS INSTRUMENTS; MPN: LM4040DIM3-5.0; OC_FARNELL: 9778330; OC_NEWARK: 97K3489; PACKAGE: SOT-23-3; SUPPLIER: TEXAS INSTRUMENTS
U$1 = EurorackModularParts:EURORACK_PCB
U$2 = EurorackModularParts:AUDIO-JACK_SMALLSYMBOL: Switching Mono 3.5mm Audio Jack from Erthenvar.; DESC: 1: A
U$3 = EurorackModularParts:AUDIO-JACK_SMALLSYMBOL: Switching Mono 3.5mm Audio Jack from Erthenvar.; DESC: 1: Out 2
U$4 = EurorackModularParts:AUDIO-JACK_SMALLSYMBOL: Switching Mono 3.5mm Audio Jack from Erthenvar.; DESC: 1: Out 1
U$5 = EurorackModularParts:AUDIO-JACK_SMALLSYMBOL: Switching Mono 3.5mm Audio Jack from Erthenvar.; DESC: 1: Out 3
U$6 = EurorackModularParts:AUDIO-JACK_SMALLSYMBOL: Switching Mono 3.5mm Audio Jack from Erthenvar.; DESC: 1: C
U$9 = EurorackModularParts:AUDIO-JACK_SMALLSYMBOL: Switching Mono 3.5mm Audio Jack from Erthenvar.; DESC: 2: A
U$12 = EurorackModularParts:AUDIO-JACK_SMALLSYMBOL: Switching Mono 3.5mm Audio Jack from Erthenvar.; DESC: VCA1 In
U$13 = EurorackModularParts:AUDIO-JACK_SMALLSYMBOL: Switching Mono 3.5mm Audio Jack from Erthenvar.; DESC: 1: B
U$14 = EurorackModularParts:AUDIO-JACK_SMALLSYMBOL: Switching Mono 3.5mm Audio Jack from Erthenvar.; DESC: VCA1 CV
U$15 = EurorackModularParts:AUDIO-JACK_SMALLSYMBOL: Switching Mono 3.5mm Audio Jack from Erthenvar.; DESC: VCA2 In
U$16 = EurorackModularParts:AUDIO-JACK_SMALLSYMBOL: Switching Mono 3.5mm Audio Jack from Erthenvar.; DESC: VCA2 CV
U$17 = EurorackModularParts:AUDIO-JACK_SMALLSYMBOL: Switching Mono 3.5mm Audio Jack from Erthenvar.; DESC: 1: Inverted
U$18 = EurorackModularParts:AUDIO-JACK_SMALLSYMBOL: Switching Mono 3.5mm Audio Jack from Erthenvar.; DESC: VCA1 Out
U$19 = EurorackModularParts:AUDIO-JACK_SMALLSYMBOL: Switching Mono 3.5mm Audio Jack from Erthenvar.; DESC: VCA2 Out
U$20 = EurorackModularParts:AUDIO-JACK_SMALLSYMBOL: Switching Mono 3.5mm Audio Jack from Erthenvar.; DESC: 2: Out 1
U$25 = EurorackModularParts:AUDIO-JACK_SMALLSYMBOL: Switching Mono 3.5mm Audio Jack from Erthenvar.; DESC: 2: B
U$26 = EurorackModularParts:AUDIO-JACK_SMALLSYMBOL: Switching Mono 3.5mm Audio Jack from Erthenvar.; DESC: 2: Out 2
U$27 = EurorackModularParts:AUDIO-JACK_SMALLSYMBOL: Switching Mono 3.5mm Audio Jack from Erthenvar.; DESC: 2: Out 3
U$28 = EurorackModularParts:AUDIO-JACK_SMALLSYMBOL: Switching Mono 3.5mm Audio Jack from Erthenvar.; DESC: 2: C
U$30 = EurorackModularParts:AUDIO-JACK_SMALLSYMBOL: Switching Mono 3.5mm Audio Jack from Erthenvar.; DESC: 2: Inverted
U$32 = EurorackModularParts:V2164

## Net classes
0 default: width 0.254 mm
1 heavypower: width 0.381 mm